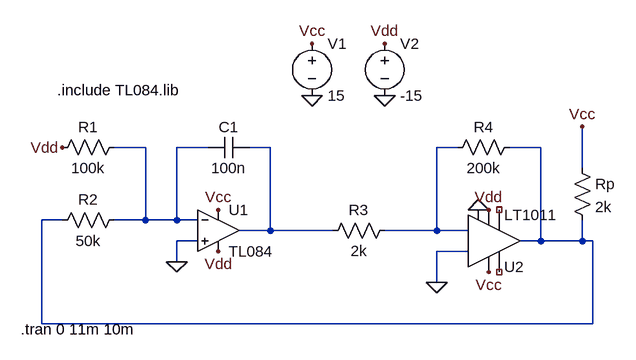
[diagram p0: schematic figb.asc]
figb.asc, the LTspice schematic file:
Version 4
SHEET 1 936 680
WIRE -544 160 -592 160
WIRE -448 160 -496 160
WIRE -352 160 -384 160
WIRE -64 160 -96 160
WIRE 64 160 16 160
WIRE 128 192 128 128
WIRE -672 272 -704 272
WIRE -544 272 -544 160
WIRE -544 272 -592 272
WIRE -496 272 -496 160
WIRE -496 272 -544 272
WIRE -464 272 -496 272
WIRE -352 288 -352 160
WIRE -352 288 -400 288
WIRE -256 288 -352 288
WIRE -96 288 -96 160
WIRE -96 288 -176 288
WIRE -48 288 -96 288
WIRE -464 304 -496 304
WIRE 64 304 64 160
WIRE 64 304 32 304
WIRE 128 304 128 272
WIRE 128 304 64 304
WIRE 144 304 128 304
WIRE -48 320 -96 320
WIRE -496 336 -496 304
WIRE -96 368 -96 320
WIRE -704 432 -704 272
WIRE 144 432 144 304
WIRE 144 432 -704 432
FLAG -288 0 Vcc
FLAG -176 0 Vdd
FLAG -288 80 0
FLAG -176 80 0
FLAG -96 368 0
FLAG -496 336 0
FLAG -432 256 Vcc
FLAG -672 160 Vdd
FLAG -432 320 Vdd
FLAG 128 128 Vcc
FLAG -16 256 Vdd
FLAG -16 352 Vcc
FLAG -32 256 0
SYMBOL voltage -288 -16 R0
WINDOW 123 0 0 Left 0
WINDOW 39 0 0 Left 0
SYMATTR InstName V1
SYMATTR Value 15
SYMBOL voltage -176 -16 R0
WINDOW 123 0 0 Left 0
WINDOW 39 0 0 Left 0
SYMATTR InstName V2
SYMATTR Value -15
SYMBOL res -576 144 R90
WINDOW 0 0 56 VBottom 2
WINDOW 3 32 56 VTop 2
SYMATTR InstName R1
SYMATTR Value 100k
SYMBOL res -576 256 R90
WINDOW 0 0 56 VBottom 2
WINDOW 3 32 56 VTop 2
SYMATTR InstName R2
SYMATTR Value 50k
SYMBOL res -160 272 R90
WINDOW 0 0 56 VBottom 2
WINDOW 3 32 56 VTop 2
SYMATTR InstName R3
SYMATTR Value 2k
SYMBOL res 32 144 R90
WINDOW 0 0 56 VBottom 2
WINDOW 3 32 56 VTop 2
SYMATTR InstName R4
SYMATTR Value 200k
SYMBOL cap -384 144 R90
WINDOW 0 0 32 VBottom 2
WINDOW 3 32 32 VTop 2
SYMATTR InstName C1
SYMATTR Value 100n
SYMBOL res 112 176 R0
SYMATTR InstName Rp
SYMATTR Value 2k
SYMBOL Comparators\\LT1011 -16 304 M180
SYMATTR InstName U2
SYMBOL Opamps\\opamp2 -432 224 R0
SYMATTR InstName U1
SYMATTR Value TL084
TEXT -680 72 Left 2 !.include TL084.lib
TEXT -736 440 Left 2 !.tran 0 11m 10m

The netlist it stands for:
* figb.asc
V1 Vcc 0 15
V2 Vdd 0 -15
R1 N001 Vdd 100k
R2 N001 N004 50k
R3 N003 N002 2k
R4 N004 N003 200k
C1 N002 N001 100n
Rp Vcc N004 2k
XU2 0 N003 0 Vdd NC_01 NC_02 N004 Vcc LT1011
XU1 0 N001 Vcc Vdd N002 TL084  ; pins In+ In- V+ V- OUT
.include TL084.lib
.tran 0 11m 10m
.lib LTC1.lib
.backanno
.end